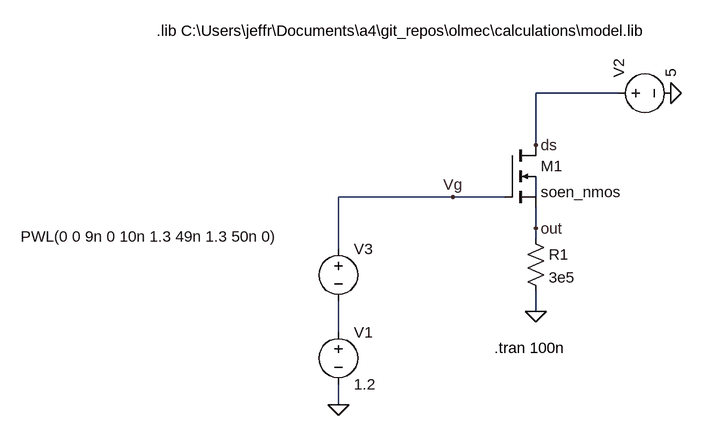
[diagram p0: schematic mosfet_pullup.asc]
mosfet_pullup.asc, the LTspice schematic file:
Version 4
SHEET 1 880 680
WIRE -144 144 -272 144
WIRE -272 224 -272 144
WIRE -400 304 -576 304
WIRE -320 304 -400 304
WIRE -272 304 -272 272
WIRE -272 352 -272 320
WIRE -272 368 -272 352
WIRE -576 384 -576 304
WIRE -272 480 -272 448
WIRE -576 512 -576 464
WIRE -576 624 -576 592
FLAG -64 144 0
FLAG -576 624 0
FLAG -272 224 ds
FLAG -400 304 Vg
FLAG -272 480 0
FLAG -272 352 out
SYMBOL voltage -160 144 R270
WINDOW 123 0 0 Left 0
WINDOW 39 0 0 Left 0
SYMATTR InstName V2
SYMATTR Value 5
SYMBOL voltage -576 368 R0
WINDOW 123 0 0 Left 0
WINDOW 39 0 0 Left 0
WINDOW 3 -489 -3 Left 2
SYMATTR Value PWL(0 0 9n 0 10n 1.3 49n 1.3 50n 0)
SYMATTR InstName V3
SYMBOL nmos4 -320 224 R0
SYMATTR InstName M1
SYMATTR Value soen_nmos
SYMATTR Value2 l=1u w=15u
SYMBOL res -288 352 R0
SYMATTR InstName R1
SYMATTR Value 3e5
SYMBOL voltage -576 496 R0
WINDOW 123 0 0 Left 0
WINDOW 39 0 0 Left 0
SYMATTR InstName V1
SYMATTR Value 1.2
TEXT -336 536 Left 2 !.tran 100n
TEXT -856 48 Left 2 !.lib C:\\Users\\jeffr\\Documents\\a4\\git_repos\\olmec\\calculations\\model.lib

The netlist it stands for:
* mosfet_pullup.asc
V2 ds 0 5
V3 Vg N002 PWL(0 0 9n 0 10n 1.3 49n 1.3 50n 0)
M1 ds Vg out N001 soen_nmos l=1u w=15u
R1 out 0 3e5
V1 N002 0 1.2
.model NMOS NMOS
.model PMOS PMOS
.lib standard.mos
.tran 100n
.lib C:\Users\jeffr\Documents\a4\git_repos\olmec\calculations\model.lib
.backanno
.end